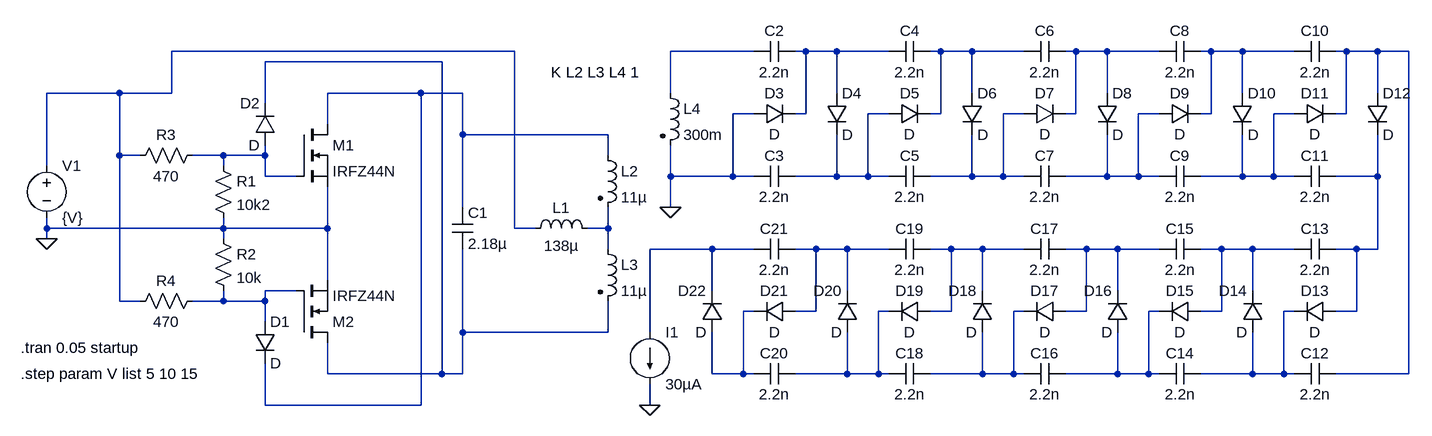
[diagram p0: schematic cascade-zvs.asc]
cascade-zvs.asc, the LTspice schematic file:
Version 4
SHEET 1 3260 680
WIRE 736 -96 208 -96
WIRE 1104 -96 976 -96
WIRE 1184 -96 1168 -96
WIRE 1232 -96 1184 -96
WIRE 1312 -96 1232 -96
WIRE 1392 -96 1376 -96
WIRE 1440 -96 1392 -96
WIRE 1520 -96 1440 -96
WIRE 1600 -96 1584 -96
WIRE 1648 -96 1600 -96
WIRE 1728 -96 1648 -96
WIRE 1808 -96 1792 -96
WIRE 1856 -96 1808 -96
WIRE 1936 -96 1856 -96
WIRE 2016 -96 2000 -96
WIRE 2064 -96 2016 -96
WIRE 2112 -96 2064 -96
WIRE 624 -80 352 -80
WIRE 128 -32 16 -32
WIRE 208 -32 208 -96
WIRE 208 -32 128 -32
WIRE 592 -32 448 -32
WIRE 656 -32 592 -32
WIRE 976 -32 976 -96
WIRE 1232 -32 1232 -96
WIRE 1440 -32 1440 -96
WIRE 1648 -32 1648 -96
WIRE 1856 -32 1856 -96
WIRE 2064 -32 2064 -96
WIRE 352 -16 352 -80
WIRE 1104 0 1072 0
WIRE 1184 0 1184 -96
WIRE 1184 0 1168 0
WIRE 1312 0 1280 0
WIRE 1392 0 1392 -96
WIRE 1392 0 1376 0
WIRE 1520 0 1488 0
WIRE 1600 0 1600 -96
WIRE 1600 0 1584 0
WIRE 1728 0 1696 0
WIRE 1808 0 1808 -96
WIRE 1808 0 1792 0
WIRE 1936 0 1904 0
WIRE 2016 0 2016 -96
WIRE 2016 0 2000 0
WIRE 448 16 448 -32
WIRE 656 32 656 -32
WIRE 880 32 656 32
WIRE 128 64 128 -32
WIRE 160 64 128 64
WIRE 288 64 240 64
WIRE 352 64 352 48
WIRE 352 64 288 64
WIRE 880 64 880 32
WIRE 16 80 16 -32
WIRE 288 80 288 64
WIRE 352 96 352 64
WIRE 400 96 352 96
WIRE 976 96 976 48
WIRE 1072 96 1072 0
WIRE 1072 96 976 96
WIRE 1104 96 1072 96
WIRE 1232 96 1232 32
WIRE 1232 96 1168 96
WIRE 1280 96 1280 0
WIRE 1280 96 1232 96
WIRE 1312 96 1280 96
WIRE 1440 96 1440 32
WIRE 1440 96 1376 96
WIRE 1488 96 1488 0
WIRE 1488 96 1440 96
WIRE 1520 96 1488 96
WIRE 1648 96 1648 32
WIRE 1648 96 1584 96
WIRE 1696 96 1696 0
WIRE 1696 96 1648 96
WIRE 1728 96 1696 96
WIRE 1856 96 1856 32
WIRE 1856 96 1792 96
WIRE 1904 96 1904 0
WIRE 1904 96 1856 96
WIRE 1936 96 1904 96
WIRE 2064 96 2064 32
WIRE 2064 96 2000 96
WIRE 656 144 656 32
WIRE 976 144 976 96
WIRE 16 176 16 160
WIRE 288 176 288 160
WIRE 288 176 16 176
WIRE 448 176 448 112
WIRE 448 176 288 176
WIRE 736 176 736 -96
WIRE 768 176 736 176
WIRE 880 176 880 144
WIRE 880 176 848 176
WIRE 16 192 16 176
WIRE 288 192 288 176
WIRE 880 208 880 176
WIRE 1040 208 944 208
WIRE 1104 208 1040 208
WIRE 1200 208 1168 208
WIRE 1248 208 1200 208
WIRE 1312 208 1248 208
WIRE 1408 208 1376 208
WIRE 1456 208 1408 208
WIRE 1520 208 1456 208
WIRE 1616 208 1584 208
WIRE 1664 208 1616 208
WIRE 1728 208 1664 208
WIRE 1824 208 1792 208
WIRE 1872 208 1824 208
WIRE 1936 208 1872 208
WIRE 2032 208 2000 208
WIRE 2064 208 2064 96
WIRE 2064 208 2032 208
WIRE 448 256 448 176
WIRE 400 272 352 272
WIRE 1040 272 1040 208
WIRE 1248 272 1248 208
WIRE 1456 272 1456 208
WIRE 1664 272 1664 208
WIRE 1872 272 1872 208
WIRE 128 288 128 64
WIRE 160 288 128 288
WIRE 288 288 288 272
WIRE 288 288 240 288
WIRE 352 288 352 272
WIRE 352 288 288 288
WIRE 1104 304 1088 304
WIRE 1200 304 1200 208
WIRE 1200 304 1168 304
WIRE 1312 304 1296 304
WIRE 1408 304 1408 208
WIRE 1408 304 1376 304
WIRE 1520 304 1504 304
WIRE 1616 304 1616 208
WIRE 1616 304 1584 304
WIRE 1728 304 1712 304
WIRE 1824 304 1824 208
WIRE 1824 304 1792 304
WIRE 1936 304 1920 304
WIRE 2032 304 2032 208
WIRE 2032 304 2000 304
WIRE 352 320 352 288
WIRE 656 336 656 208
WIRE 880 336 880 288
WIRE 880 336 656 336
WIRE 944 336 944 208
WIRE 448 400 448 352
WIRE 624 400 624 -80
WIRE 624 400 448 400
WIRE 656 400 656 336
WIRE 656 400 624 400
WIRE 1040 400 1040 336
WIRE 1088 400 1088 304
WIRE 1088 400 1040 400
WIRE 1104 400 1088 400
WIRE 1248 400 1248 336
WIRE 1248 400 1168 400
WIRE 1296 400 1296 304
WIRE 1296 400 1248 400
WIRE 1312 400 1296 400
WIRE 1456 400 1456 336
WIRE 1456 400 1376 400
WIRE 1504 400 1504 304
WIRE 1504 400 1456 400
WIRE 1520 400 1504 400
WIRE 1664 400 1664 336
WIRE 1664 400 1584 400
WIRE 1712 400 1712 304
WIRE 1712 400 1664 400
WIRE 1728 400 1712 400
WIRE 1872 400 1872 336
WIRE 1872 400 1792 400
WIRE 1920 400 1920 304
WIRE 1920 400 1872 400
WIRE 1936 400 1920 400
WIRE 2112 400 2112 -96
WIRE 2112 400 2000 400
WIRE 352 448 352 384
WIRE 592 448 592 -32
WIRE 592 448 352 448
WIRE 944 448 944 416
FLAG 16 192 0
FLAG 976 144 0
FLAG 944 448 0
SYMBOL voltage 16 64 R0
WINDOW 123 0 0 Left 2
WINDOW 39 0 0 Left 2
SYMATTR InstName V1
SYMATTR Value {V}
SYMBOL ind 752 192 R270
WINDOW 0 32 56 VTop 2
WINDOW 3 5 56 VBottom 2
SYMATTR InstName L1
SYMATTR Value 138µ
SYMBOL nmos 400 16 R0
SYMATTR InstName M1
SYMATTR Value IRFZ44N
SYMBOL nmos 400 352 M180
SYMATTR InstName M2
SYMATTR Value IRFZ44N
SYMBOL res 272 64 R0
SYMATTR InstName R1
SYMATTR Value 10k2
SYMBOL res 272 176 R0
SYMATTR InstName R2
SYMATTR Value 10k
SYMBOL cap 640 144 R0
SYMATTR InstName C1
SYMATTR Value 2.18µ
SYMBOL ind2 864 48 R0
SYMATTR InstName L2
SYMATTR Value 11µ
SYMATTR Type ind
SYMBOL res 256 48 R90
WINDOW 0 0 56 VBottom 2
WINDOW 3 32 56 VTop 2
SYMATTR InstName R3
SYMATTR Value 470
SYMBOL res 256 272 R90
WINDOW 0 0 56 VBottom 2
WINDOW 3 32 56 VTop 2
SYMATTR InstName R4
SYMATTR Value 470
SYMBOL diode 336 320 R0
SYMATTR InstName D1
SYMBOL diode 368 48 R180
WINDOW 0 24 64 Left 2
WINDOW 3 24 0 Left 2
SYMATTR InstName D2
SYMBOL ind2 960 -48 R0
SYMATTR InstName L4
SYMATTR Value 300m
SYMATTR Type ind
SYMBOL ind2 864 192 R0
SYMATTR InstName L3
SYMATTR Value 11µ
SYMATTR Type ind
SYMBOL cap 1168 -112 R90
WINDOW 0 0 32 VBottom 2
WINDOW 3 32 32 VTop 2
SYMATTR InstName C2
SYMATTR Value 2.2n
SYMBOL cap 1168 80 R90
WINDOW 0 0 32 VBottom 2
WINDOW 3 32 32 VTop 2
SYMATTR InstName C3
SYMATTR Value 2.2n
SYMBOL diode 1104 -16 M90
WINDOW 0 0 32 VBottom 2
WINDOW 3 32 32 VTop 2
SYMATTR InstName D3
SYMBOL diode 1216 -32 R0
SYMATTR InstName D4
SYMBOL cap 1376 -112 R90
WINDOW 0 0 32 VBottom 2
WINDOW 3 32 32 VTop 2
SYMATTR InstName C4
SYMATTR Value 2.2n
SYMBOL cap 1376 80 R90
WINDOW 0 0 32 VBottom 2
WINDOW 3 32 32 VTop 2
SYMATTR InstName C5
SYMATTR Value 2.2n
SYMBOL diode 1312 -16 M90
WINDOW 0 0 32 VBottom 2
WINDOW 3 32 32 VTop 2
SYMATTR InstName D5
SYMBOL diode 1424 -32 R0
SYMATTR InstName D6
SYMBOL cap 1584 -112 R90
WINDOW 0 0 32 VBottom 2
WINDOW 3 32 32 VTop 2
SYMATTR InstName C6
SYMATTR Value 2.2n
SYMBOL cap 1584 80 R90
WINDOW 0 0 32 VBottom 2
WINDOW 3 32 32 VTop 2
SYMATTR InstName C7
SYMATTR Value 2.2n
SYMBOL diode 1520 -16 M90
WINDOW 0 0 32 VBottom 2
WINDOW 3 32 32 VTop 2
SYMATTR InstName D7
SYMBOL diode 1632 -32 R0
SYMATTR InstName D8
SYMBOL cap 1792 -112 R90
WINDOW 0 0 32 VBottom 2
WINDOW 3 32 32 VTop 2
SYMATTR InstName C8
SYMATTR Value 2.2n
SYMBOL cap 1792 80 R90
WINDOW 0 0 32 VBottom 2
WINDOW 3 32 32 VTop 2
SYMATTR InstName C9
SYMATTR Value 2.2n
SYMBOL diode 1728 -16 M90
WINDOW 0 0 32 VBottom 2
WINDOW 3 32 32 VTop 2
SYMATTR InstName D9
SYMBOL diode 1840 -32 R0
SYMATTR InstName D10
SYMBOL cap 2000 -112 R90
WINDOW 0 0 32 VBottom 2
WINDOW 3 32 32 VTop 2
SYMATTR InstName C10
SYMATTR Value 2.2n
SYMBOL cap 2000 80 R90
WINDOW 0 0 32 VBottom 2
WINDOW 3 32 32 VTop 2
SYMATTR InstName C11
SYMATTR Value 2.2n
SYMBOL diode 1936 -16 M90
WINDOW 0 0 32 VBottom 2
WINDOW 3 32 32 VTop 2
SYMATTR InstName D11
SYMBOL diode 2048 -32 R0
SYMATTR InstName D12
SYMBOL cap 1936 416 R270
WINDOW 0 32 32 VTop 2
WINDOW 3 0 32 VBottom 2
SYMATTR InstName C12
SYMATTR Value 2.2n
SYMBOL cap 1936 224 R270
WINDOW 0 32 32 VTop 2
WINDOW 3 0 32 VBottom 2
SYMATTR InstName C13
SYMATTR Value 2.2n
SYMBOL diode 2000 320 M270
WINDOW 0 32 32 VTop 2
WINDOW 3 0 32 VBottom 2
SYMATTR InstName D13
SYMBOL diode 1888 336 R180
WINDOW 0 24 64 Left 2
WINDOW 3 24 0 Left 2
SYMATTR InstName D14
SYMBOL cap 1728 416 R270
WINDOW 0 32 32 VTop 2
WINDOW 3 0 32 VBottom 2
SYMATTR InstName C14
SYMATTR Value 2.2n
SYMBOL cap 1728 224 R270
WINDOW 0 32 32 VTop 2
WINDOW 3 0 32 VBottom 2
SYMATTR InstName C15
SYMATTR Value 2.2n
SYMBOL diode 1792 320 M270
WINDOW 0 32 32 VTop 2
WINDOW 3 0 32 VBottom 2
SYMATTR InstName D15
SYMBOL diode 1680 336 R180
WINDOW 0 24 64 Left 2
WINDOW 3 24 0 Left 2
SYMATTR InstName D16
SYMBOL cap 1520 416 R270
WINDOW 0 32 32 VTop 2
WINDOW 3 0 32 VBottom 2
SYMATTR InstName C16
SYMATTR Value 2.2n
SYMBOL cap 1520 224 R270
WINDOW 0 32 32 VTop 2
WINDOW 3 0 32 VBottom 2
SYMATTR InstName C17
SYMATTR Value 2.2n
SYMBOL diode 1584 320 M270
WINDOW 0 32 32 VTop 2
WINDOW 3 0 32 VBottom 2
SYMATTR InstName D17
SYMBOL diode 1472 336 R180
WINDOW 0 24 64 Left 2
WINDOW 3 24 0 Left 2
SYMATTR InstName D18
SYMBOL cap 1312 416 R270
WINDOW 0 32 32 VTop 2
WINDOW 3 0 32 VBottom 2
SYMATTR InstName C18
SYMATTR Value 2.2n
SYMBOL cap 1312 224 R270
WINDOW 0 32 32 VTop 2
WINDOW 3 0 32 VBottom 2
SYMATTR InstName C19
SYMATTR Value 2.2n
SYMBOL diode 1376 320 M270
WINDOW 0 32 32 VTop 2
WINDOW 3 0 32 VBottom 2
SYMATTR InstName D19
SYMBOL diode 1264 336 R180
WINDOW 0 24 64 Left 2
WINDOW 3 24 0 Left 2
SYMATTR InstName D20
SYMBOL cap 1104 416 R270
WINDOW 0 32 32 VTop 2
WINDOW 3 0 32 VBottom 2
SYMATTR InstName C20
SYMATTR Value 2.2n
SYMBOL cap 1104 224 R270
WINDOW 0 32 32 VTop 2
WINDOW 3 0 32 VBottom 2
SYMATTR InstName C21
SYMATTR Value 2.2n
SYMBOL diode 1168 320 M270
WINDOW 0 32 32 VTop 2
WINDOW 3 0 32 VBottom 2
SYMATTR InstName D21
SYMBOL diode 1056 336 R180
WINDOW 0 24 64 Left 2
WINDOW 3 24 0 Left 2
SYMATTR InstName D22
SYMBOL load2 944 336 R0
WINDOW 123 0 0 Left 2
WINDOW 39 0 0 Left 2
SYMATTR InstName I1
SYMATTR Value 30µA
TEXT -24 360 Left 2 !.tran 0.05 startup
TEXT 792 -64 Left 2 !K L2 L3 L4 1
TEXT -24 400 Left 2 !.step param V list 5 10 15

The netlist it stands for:
* cascade-zvs.asc
V1 N001 0 {V}
L1 N001 N016 138µ
M1 N009 N014 0 0 IRFZ44N
M2 N008 N022 0 0 IRFZ44N
R1 N014 0 10k2
R2 0 N022 10k
C1 N009 N008 2.18µ
L2 N009 N016 11µ
R3 N014 N001 470
R4 N022 N001 470
D1 N022 N009 D
D2 N014 N008 D
L4 N002 0 300m
L3 N016 N008 11µ
C2 N003 N002 2.2n
C3 N010 0 2.2n
D3 0 N003 D
D4 N003 N010 D
C4 N004 N003 2.2n
C5 N011 N010 2.2n
D5 N010 N004 D
D6 N004 N011 D
C6 N005 N004 2.2n
C7 N012 N011 2.2n
D7 N011 N005 D
D8 N005 N012 D
C8 N006 N005 2.2n
C9 N013 N012 2.2n
D9 N012 N006 D
D10 N006 N013 D
C10 N007 N006 2.2n
C11 N015 N013 2.2n
D11 N013 N007 D
D12 N007 N015 D
C12 N027 N007 2.2n
C13 N021 N015 2.2n
D13 N015 N027 D
D14 N027 N021 D
C14 N026 N027 2.2n
C15 N020 N021 2.2n
D15 N021 N026 D
D16 N026 N020 D
C16 N025 N026 2.2n
C17 N019 N020 2.2n
D17 N020 N025 D
D18 N025 N019 D
C18 N024 N025 2.2n
C19 N018 N019 2.2n
D19 N019 N024 D
D20 N024 N018 D
C20 N023 N024 2.2n
C21 N017 N018 2.2n
D21 N018 N023 D
D22 N023 N017 D
I1 N017 0 30µA
.model D D
.lib standard.dio
.model NMOS NMOS
.model PMOS PMOS
.lib standard.mos
.tran 0.05 startup
K L2 L3 L4 1
.step param V list 5 10 15
.backanno
.end